# Altium schematic sheet Power_Sheet.SchDoc (part 1 of 3)
size 420 x 297 mm; SheetNumber: 2; SheetTotal: 10
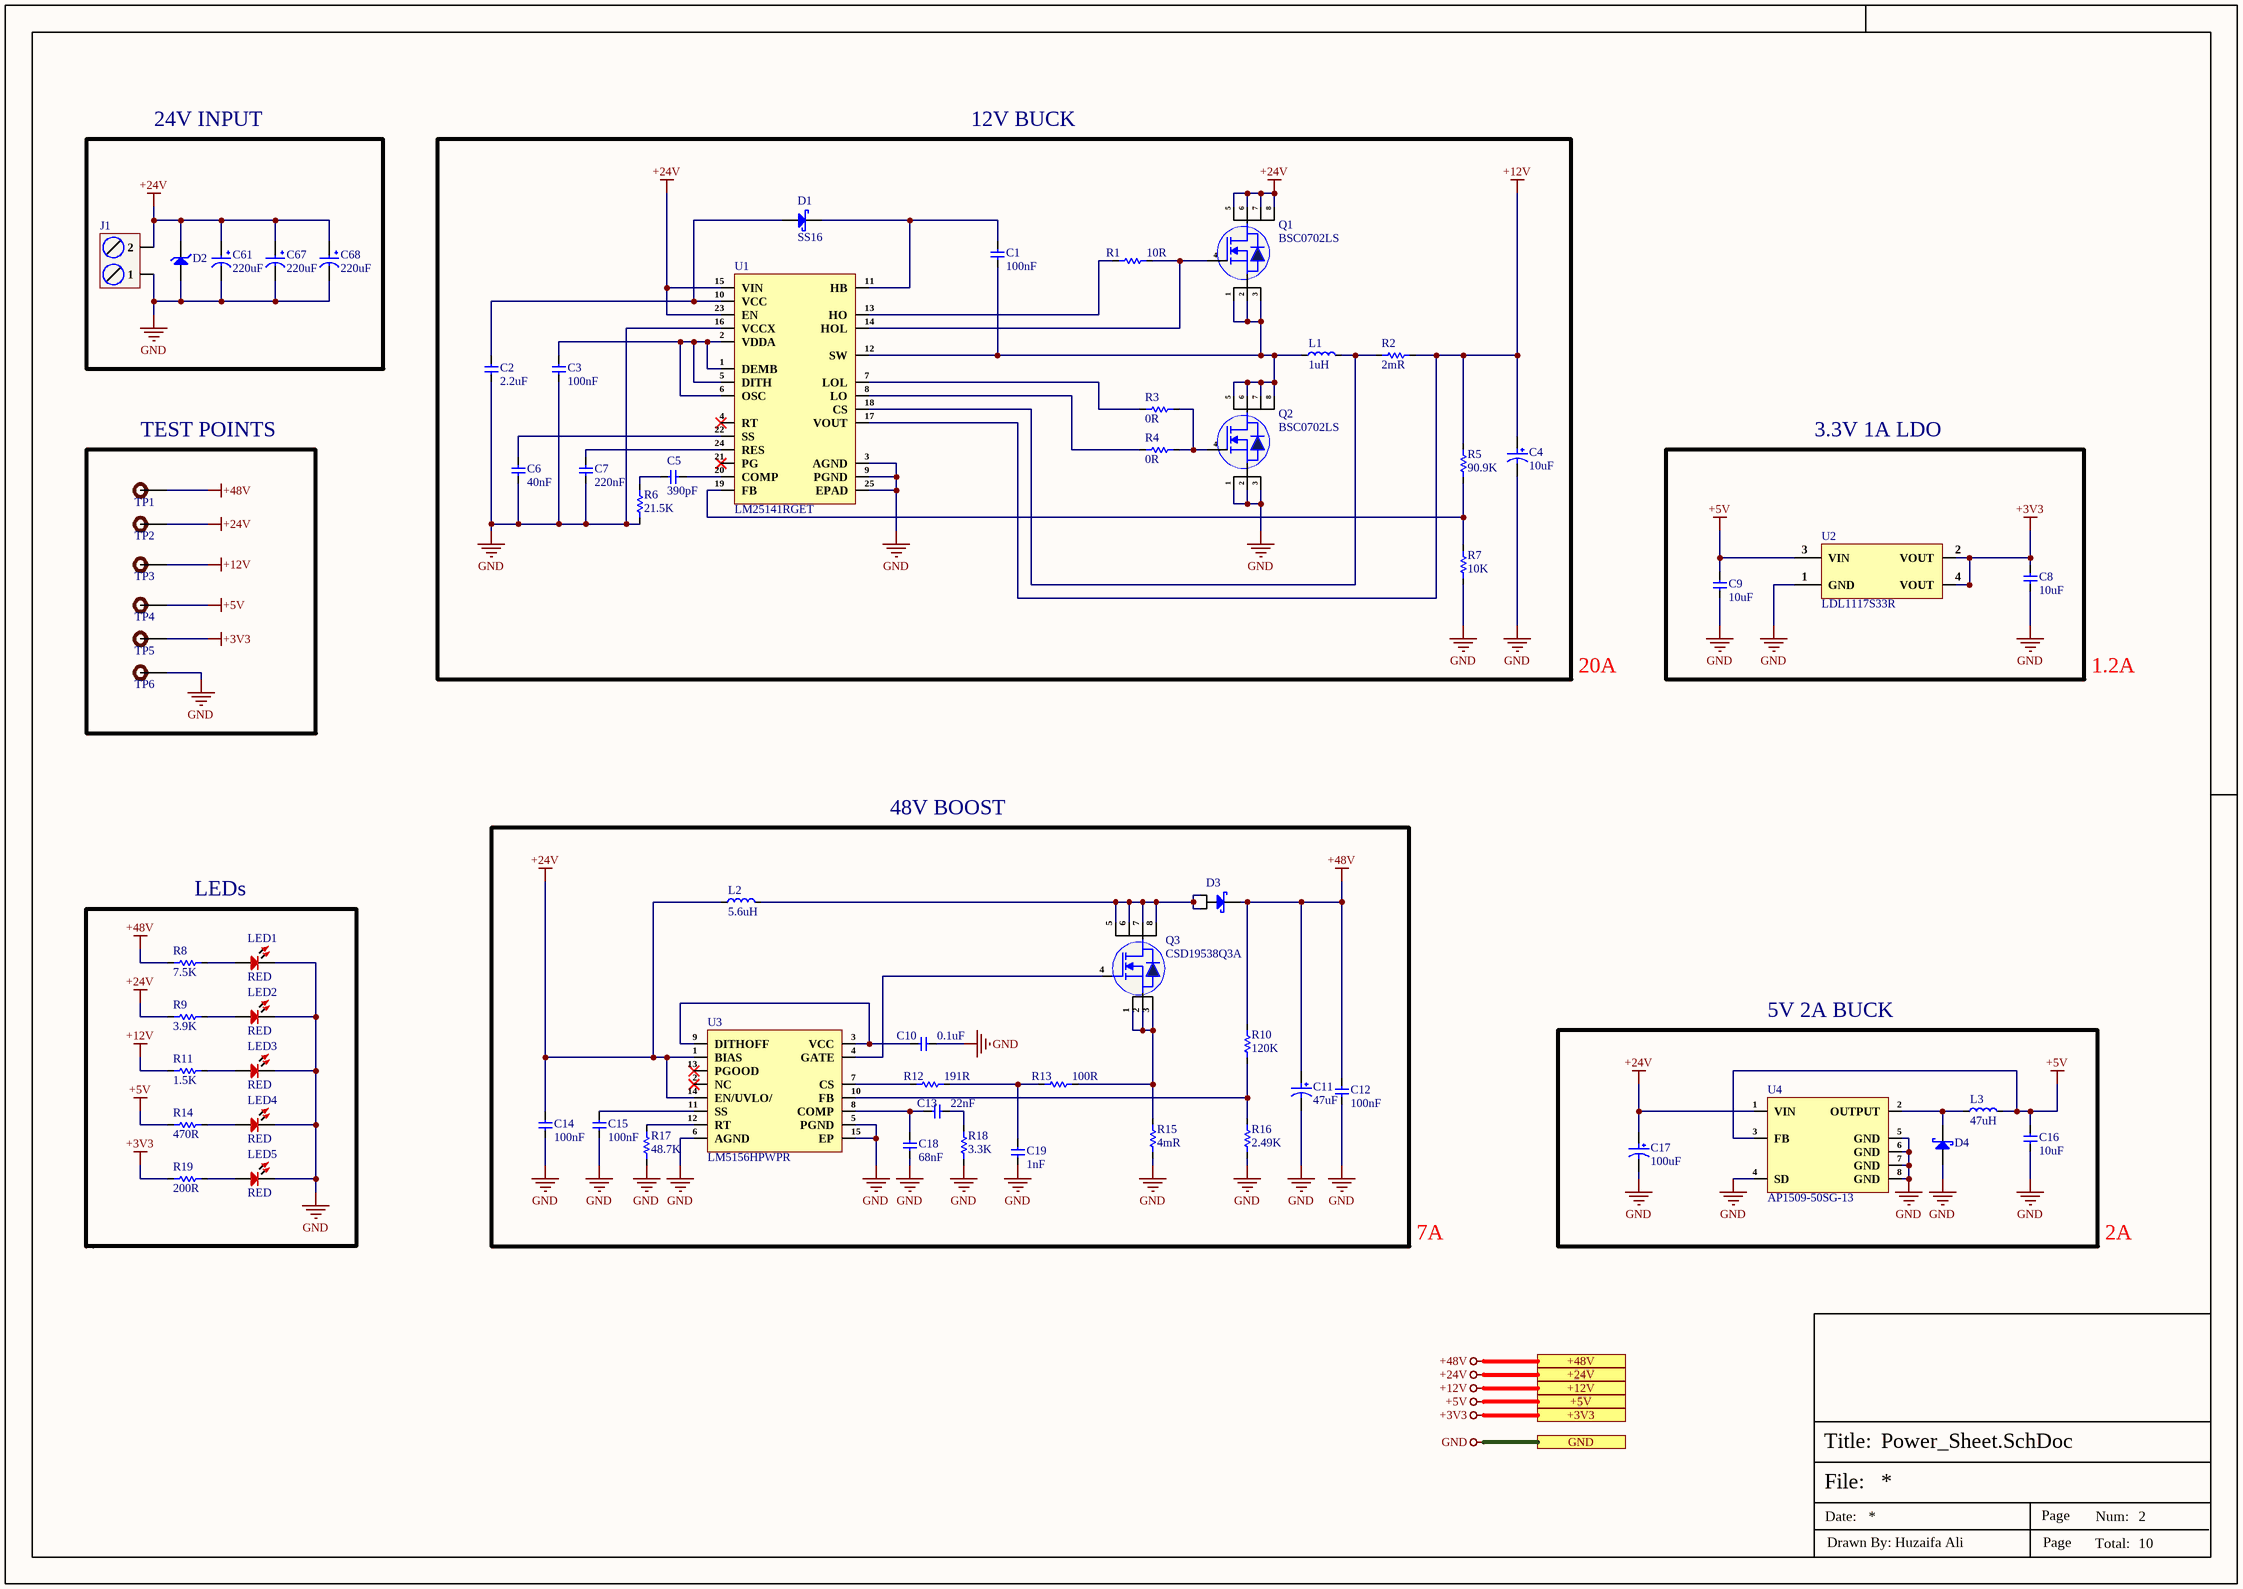
[diagram p0: Power_Sheet.SchDoc]

## Parts
C1  100nF  [cap-0402]
C2  2.2uF  [Cap-0805]
C3  100nF  [cap-0402]
C4  10uF  [50SVPF10M]
C5  390pF  [Cap-0402]
C6  40nF  [Cap-0805]
C7  220nF  [Cap-0402]
C8  10uF  [Cap-0603]
C9  10uF  [Cap-0603]
C10  0.1uF  [Cap-0402]
C11  47uF  [25SVPF47M]
C12  100nF  [cap-0402]
C13  22nF  [Cap-0402]
C14  100nF  [cap-0402]
C15  100nF  [cap-0402]
C16  10uF  [Cap-0603]
C17  100uF  [RVT1A101M0605]
C18  68nF  [Cap-0402]
C19  1nF  [Cap-0402]
C61  220uF  [UCD-220uF-10mmDia]
C67  220uF  [UCD-220uF-10mmDia]
C68  220uF  [UCD-220uF-10mmDia]
D1  SS16  [SMA]
D2  SMBJ28A-13-F  [SMB_]  (value not drawn)
D3  STPS20M100SG-TR  [D2Pak.]  (value not drawn)
D4  B150-13-F  [SMA]  (value not drawn)
J1  MXHB9500-9.5-02P-BK01-Cu-S-A  [MXHB9500-9.5-02P-BK01-Cu-S-A]  (value not drawn)
L1  1uH
L2  5.6uH  [FXL1360-5R6-M]
L3  47uH  [CYA0650-47UH]
LED1  RED  [LED-0603]
LED2  RED  [LED-0603]
LED3  RED  [LED-0603]
LED4  RED  [LED-0603]
LED5  RED  [LED-0603]
Q1  BSC0702LS  [PG-TDSON-8]
Q2  BSC0702LS  [PG-TDSON-8]
Q3  CSD19538Q3A  [VSONP-8(3.1x3.1)]
R1  10R  [Res-0402]
R2  2mR  [RES 3920]
R3  0R  [Res-0402]
R4  0R  [Res-0402]
R5  90.9K  [Res-0402]
R6  21.5K  [Res-0402]
R7  10K  [Res-0402]
R8  7.5K  [Res-0402]
R9  3.9K  [Res-0402]
R10  120K  [Res-0402]
R11  1.5K  [Res-0402]
R12  191R  [Res-0402]
R13  100R  [Res-0402]
R14  470R  [Res-0402]
R15  4mR  [Res-1206]
R16  2.49K  [Res-0402]
R17  48.7K  [Res-0603]
R18  3.3K  [Res-0402]
R19  200R  [Res-0402]
TP1  TEST POINT  [Test-point]  (value not drawn)  (no BOM)
TP2  TEST POINT  [Test-point]  (value not drawn)  (no BOM)
TP3  TEST POINT  [Test-point]  (value not drawn)  (no BOM)
TP4  TEST POINT  [Test-point]  (value not drawn)  (no BOM)
TP5  TEST POINT  [Test-point]  (value not drawn)  (no BOM)
TP6  TEST POINT  [Test-point]  (value not drawn)  (no BOM)
U1  LM25141RGET  [24-WQFN (4x4)]
U2  LDL1117S33R  [SOT- 223]
U3  LM5156HPWPR  [HTSSOP-14-EP]
U4  AP1509-50SG-13  [SOP-8]

## Blocks framed on the sheet
24V INPUT: C61 C67 C68 D2 J1
12V BUCK: C1-C7 D1 L1 Q1 Q2 R1-R7 U1
TEST POINTS: TP1-TP6
3.3V 1A LDO: C8 C9 U2
48V BOOST: C10-C15 C18 C19 D3 L2 Q3 R10 R12 R13 R15-R18 U3
5V 2A BUCK: C16 C17 D4 L3 U4

## Ports
+3V3 (see Top_Sheet[1A], CAN_Sheet[5D], Controller_Sheet[5D], EtherCAT_Sheet[5D], RJ45_Sheet[5D], RS485_RS232_Sheet[5D]), +5V (see Top_Sheet[1A], CAN_Sheet[5D]), +12V (see Top_Sheet[1A], Relay_PWR_Sheet[5D]), +24V (see Top_Sheet[1A], Connector_Sheet[5D], Relay_PWR_Sheet[5D], Relay_Sheet[5D]), +48V (see Top_Sheet[1A], Relay_PWR_Sheet[5D]), GND (see Top_Sheet[1A], CAN_Sheet[5D], Connector_Sheet[5D], Controller_Sheet[5D], EtherCAT_Sheet[5D], Relay_Sheet[5D], RJ45_Sheet[5D], RS485_RS232_Sheet[5D])

## Nets
+3V3: C8.2 R19.1 TP5.1 U2.2(VOUT) U2.4(VOUT) ; port +3V3
+5V: C9.2 C16.2 L3.2 R14.1 TP4.1 U2.3(VIN) U4.3(FB) ; port +5V
+12V: C4.1 R2.2 R5.2 R11.1 TP3.1 U1.17(VOUT) ; port +12V
+24V: C14.2 C17.1 C61.1 C67.1 C68.1 D2.2(K) J1.2 L2.1 Q1.5(D) Q1.6(D) Q1.7(D) Q1.8(D) R9.1 TP2.1 U1.15(VIN) U1.23(EN) U3.1(BIAS) U3.14(EN/UVLO/) U4.1(VIN) ; port +24V
+48V: C11.1 C12.2 D3.3(K) R8.1 R10.2 TP1.1 ; port +48V
GND: C2.1 C3.1 C4.2 C6.1 C7.1 C8.1 C9.1 C10.1 C11.2 C12.1 C14.1 C15.1 C16.1 C17.2 C18.1 C19.1 C61.2 C67.2 C68.2 D2.1(A) D4.2(A) J1.1 LED1.2 LED2.2 LED3.2 LED4.2 LED5.2 Q2.1(S) Q2.2(S) Q2.3(S) R6.1 R7.1 R15.1 R16.1 R17.1 R18.2 TP6.1 U1.3(AGND) U1.9(PGND) U1.16(VCCX) U1.25(EPAD) U2.1(GND) U3.5(PGND) U3.6(AGND) U3.15(EP) U4.4(SD) U4.5(GND) U4.6(GND) U4.7(GND) U4.8(GND) ; port GND
NetC1_1: C1.1 L1.1 Q1.1(S) Q1.2(S) Q1.3(S) Q2.5(D) Q2.6(D) Q2.7(D) Q2.8(D) U1.12(SW)
NetC1_2: C1.2 D1.1(K) U1.11(HB)
NetC2_2: C2.2 D1.2(A) U1.10(VCC)
NetC3_2: C3.2 U1.1(DEMB) U1.2(VDDA) U1.5(DITH) U1.6(OSC)
NetC5_1: C5.1 R6.2
NetC5_2: C5.2 U1.20(COMP)
NetC6_2: C6.2 U1.22(SS)
NetC7_2: C7.2 U1.24(RES)
NetC10_2: C10.2 U3.3(VCC) U3.9(DITHOFF)
NetC13_1: C13.1 R18.1
NetC13_2: C13.2 C18.2 U3.8(COMP)
NetC15_2: C15.2 U3.11(SS)
NetC19_2: C19.2 R12.2 R13.1
NetD3_1: D3.1(A) D3.2(A) L2.2 Q3.5(D) Q3.6(D) Q3.7(D) Q3.8(D)
NetD4_1: D4.1(K) L3.1 U4.2(OUTPUT)
NetL1_2: L1.2 R2.1 U1.18(CS)
NetLED1_1: LED1.1 R8.2
NetLED2_1: LED2.1 R9.2
NetLED3_1: LED3.1 R11.2
NetLED4_1: LED4.1 R14.2
NetLED5_1: LED5.1 R19.2
NetQ1_4: Q1.4(G) R1.2 U1.14(HOL)
NetQ2_4: Q2.4(G) R3.2 R4.2
NetQ3_1: Q3.1(S) Q3.2(S) Q3.3(S) R13.2 R15.2
NetQ3_4: Q3.4(G) U3.4(GATE)
NetR1_1: R1.1 U1.13(HO)
NetR3_1: R3.1 U1.7(LOL)
NetR4_1: R4.1 U1.8(LO)
NetR5_1: R5.1 R7.2 U1.19(FB)
NetR10_1: R10.1 R16.2 U3.10(FB)
NetR12_1: R12.1 U3.7(CS)
NetR17_2: R17.2 U3.12(RT)

Not connected (* = marked no-connect by the designer): U1 4(RT)* 21(PG)*; U3 2(NC)* 13(PGOOD)*

## Notes on the sheet
- 20A
- 1.2A
- LEDs
- 7A
- 2A
- File:
- Title:
- Date:
- Page
- Num:
- Total:
- Drawn By: Huzaifa Ali